# Altium schematic sheet User - LED Indicators.SchDoc
size A; SheetNumber: 9; SheetTotal: 11
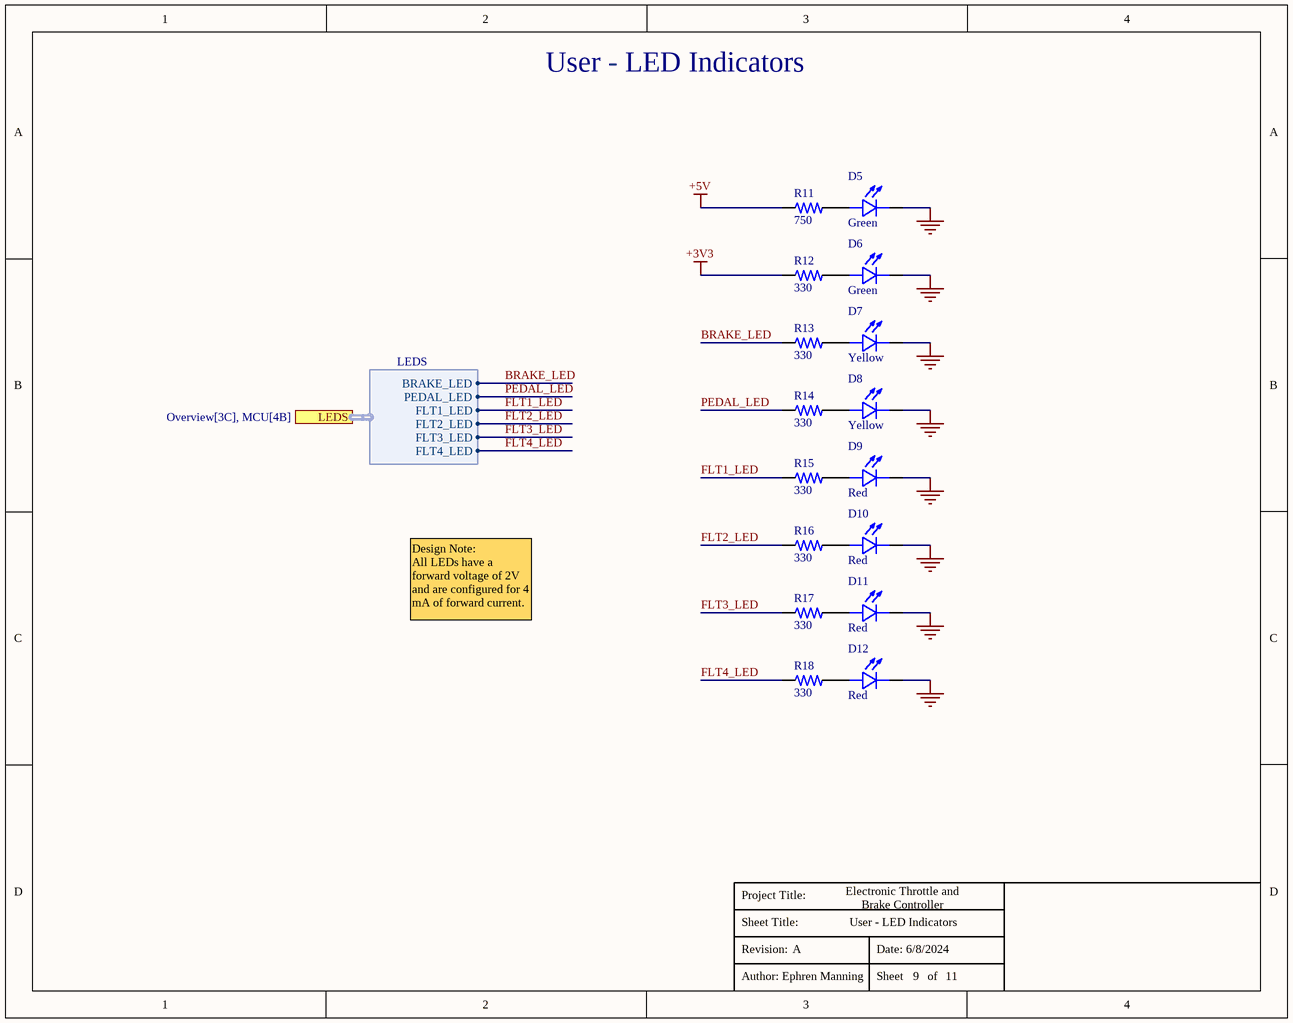
[diagram p0: User - LED Indicators.SchDoc]

## Parts
D5  Green  [Wurth-LED-0603-Footprint]
D6  Green  [Wurth-LED-0603-Footprint]
D7  Yellow  [Wurth-LED-0603-Footprint]
D8  Yellow  [Wurth-LED-0603-Footprint]
D9  Red  [LED_150060RS75000]
D10  Red  [LED_150060RS75000]
D11  Red  [LED_150060RS75000]
D12  Red  [LED_150060RS75000]
R11  750  [RES_0402-Footprint-1]
R12  330  [RES_0402-Footprint-1]
R13  330  [RES_0402-Footprint-1]
R14  330  [RES_0402-Footprint-1]
R15  330  [RES_0402-Footprint-1]
R16  330  [RES_0402-Footprint-1]
R17  330  [RES_0402-Footprint-1]
R18  330  [RES_0402-Footprint-1]

## Ports
LEDS (harness LEDS, see Overview[3C], MCU[4B])

## Harnesses
LEDS: BRAKE_LED, PEDAL_LED, FLT1_LED, FLT2_LED, FLT3_LED, FLT4_LED

## Nets
+3V3: R12.1
+5V: R11.1
GND: D5.C D6.C D7.C D8.C D9.C D10.C D11.C D12.C
BRAKE_LED: R13.1 ; port LEDS.BRAKE_LED
FLT1_LED: R15.1 ; port LEDS.FLT1_LED
FLT2_LED: R16.1 ; port LEDS.FLT2_LED
FLT3_LED: R17.1 ; port LEDS.FLT3_LED
FLT4_LED: R18.1 ; port LEDS.FLT4_LED
PEDAL_LED: R14.1 ; port LEDS.PEDAL_LED
NetD5_A: D5.A R11.2
NetD6_A: D6.A R12.2
NetD7_A: D7.A R13.2
NetD8_A: D8.A R14.2
NetD9_A: D9.A R15.2
NetD10_A: D10.A R16.2
NetD11_A: D11.A R17.2
NetD12_A: D12.A R18.2

## Notes on the sheet
- User - LED Indicators
- Design Note:
  All LEDs have a forward voltage of 2V and are configured for 4 mA of forward current.
- Electronic Throttle and
  Brake Controller
- A
- 6/8/2024
- Ephren Manning
- 9
- 11
- Project Title:
- Sheet Title:
- Revision:
- Date:
- Author:
- Sheet        of

## Library data of the parts
D5 D6 = CMP-00076-2: LED GREEN CLEAR 0603 2V Forward Voltage; Manufacturer 1: Würth Elektronik; Manufacturer Part Number 1: 150060VS75000; Digikey Part Number: 732-4980-1-ND
D7 D8 = CMP-00077-1: LED YELLOW CLEAR 0603 2V Forward Voltage; Manufacturer 1: Würth Elektronik; Manufacturer Part Number 1: 150060YS75000; Digikey Part Number: 732-4981-1-ND
D9-D12 = CMP-120-000000-3: CLEAR RED LEAD 0603 2V Forward Voltage; Manufacturer 1: Würth Elektronik; Manufacturer Part Number 1: 150060RS75000; Digikey Part Number: 732-4978-1-ND
R11 = CMP-00078-1: 750 1% 1/16W 0402 Thick Film; Manufacturer Part Number 1: RC0402FR-07750RL; Manufacturer 1: YAGEO; Digikey Part Number: 311-750LRCT-ND
R12-R18 = CMP-00079-1: 330 1% 1/16W 0402 Thick Film; Manufacturer Part Number 1: RC0402FR-07330RL; Manufacturer 1: YAGEO; Digikey Part Number: 311-330LRCT-ND